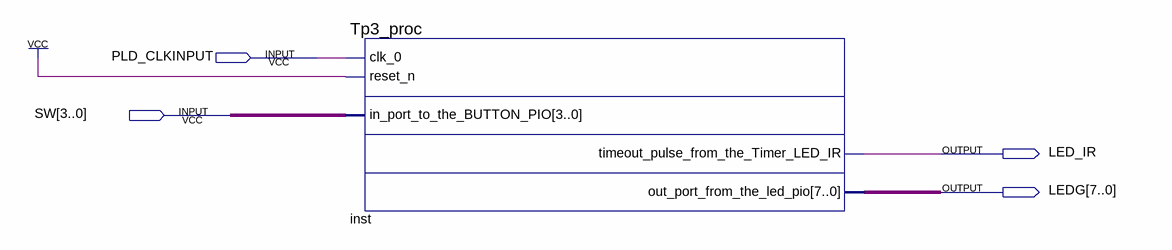
[diagram p0: schematic sheet]
// Quartus schematic TP3.bdf as structural Verilog: 1 symbols, 4 pins
module TP3 (
  input  PLD_CLKINPUT,
  input  [3:0] SW,
  output LED_IR,
  output [7:0] LEDG
);

  Tp3_proc inst (
    .clk_0(PLD_CLKINPUT), .reset_n(1'b1), .in_port_to_the_BUTTON_PIO(SW),
    .timeout_pulse_from_the_Timer_LED_IR(LED_IR), .out_port_from_the_led_pio(LEDG));
endmodule
